# Altium project Field Sensor ESP32.PrjPCB
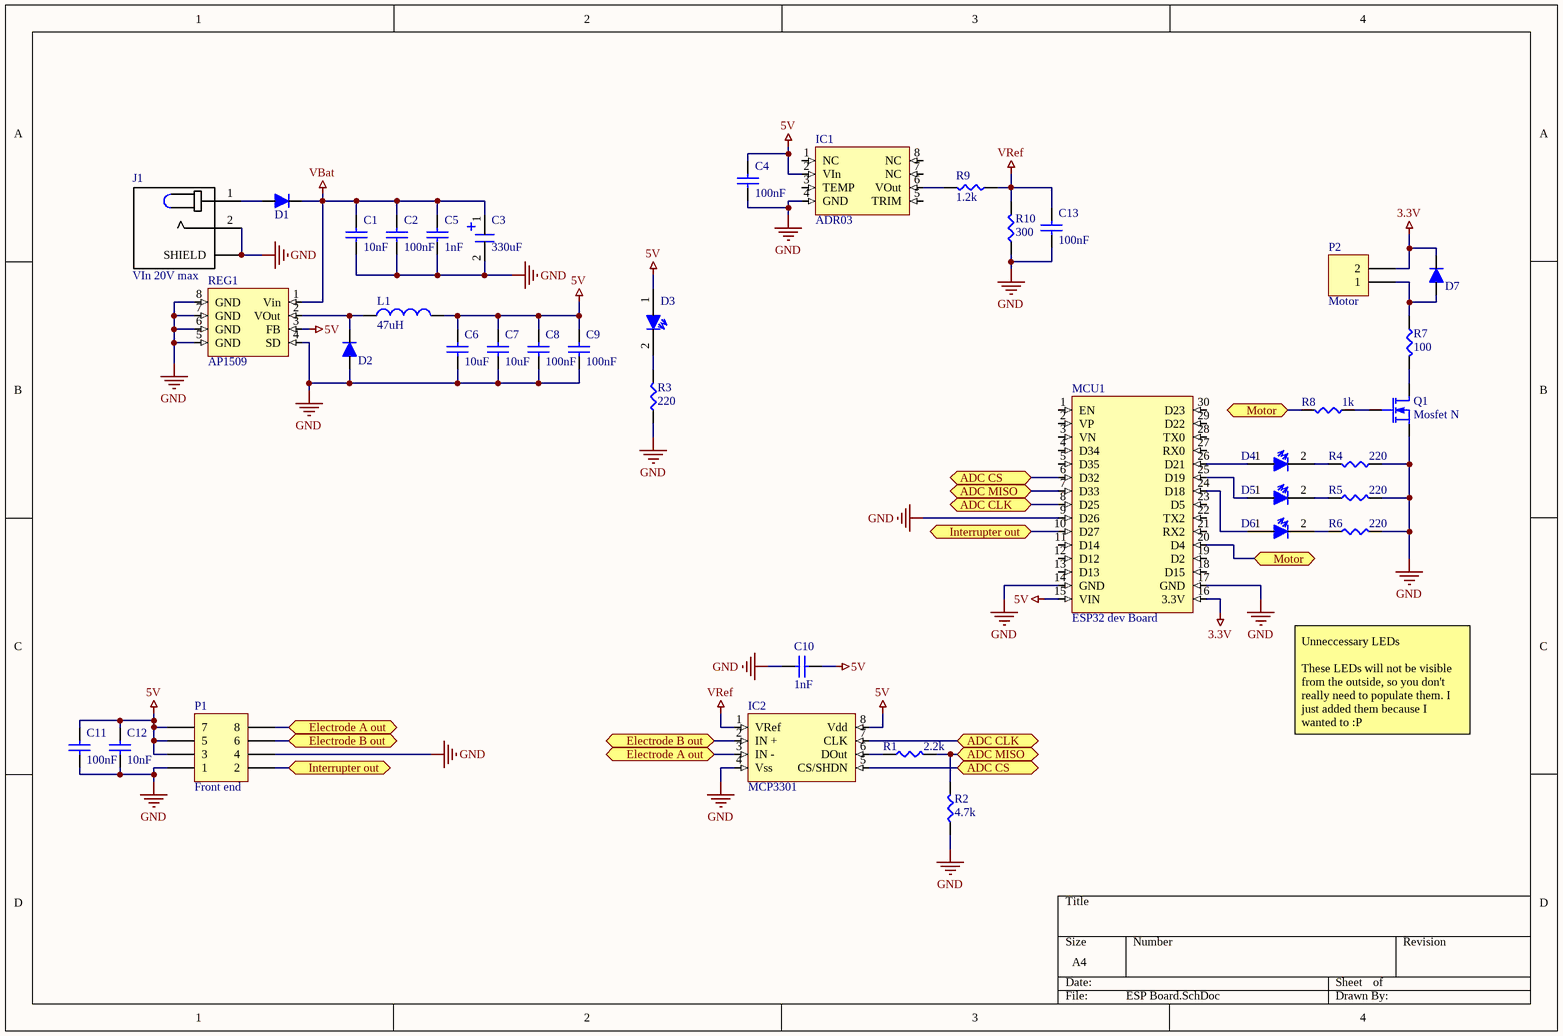
[diagram p0: ESP Board.SchDoc]
1 sheet, 39 parts. Net scope: flat (ports and power ports of the same name join across sheets).
Board file: ESP BOard.PcbDoc

## Sheet ESP Board.SchDoc
size A4

### Parts
C1  10nF  [0805]
C2  100nF  [0805]
C3  330uF  [ESL476M100AH9AA]
C4  100nF  [0805]
C5  1nF  [0805]
C6  10uF  [0805]
C7  10uF  [0805]
C8  100nF  [0805]
C9  100nF  [0805]
C10  1nF  [0805]
C11  100nF  [0805]
C12  10nF  [0805]
C13  100nF  [0805]
D1  Diode  [DO-214]  (value not drawn)
D2  Diode  [DO-214]  (value not drawn)
D3  Power  [0805]  (value not drawn)
D4  NOP  [0805]  (value not drawn)
D5  NOP  [0805]  (value not drawn)
D6  NOP  [0805]  (value not drawn)
D7  Diode  [DO-214]  (value not drawn)
IC1  ADR03  [SOIC8]
IC2  MCP3301  [SOIC8]
J1  VIn 20V max  [PJ-082BH]
L1  47uH  [1812 Low density]
MCU1  ESP32 dev Board  [ESP32 dev board]
P1  Front end  [HDR2X4]
P2  Motor  [XH2]
Q1  Mosfet N  [sot 23]
R1  2.2k  [0805]
R2  4.7k  [0805]
R3  220  [0805]
R4  220  [0805]
R5  220  [0805]
R6  220  [0805]
R7  100  [0805]
R8  1k  [0805]
R9  1.2k  [0805]
R10  300  [0805]
REG1  AP1509  [SOIC8]

### Ports
ADC CLK (bidir), ADC CS (bidir), ADC MISO (bidir), Electrode A out (bidir), Electrode B out (bidir), Interrupter out (bidir), Motor (bidir)

### Nets
3.3V: D7.2 MCU1.16(3.3V) P2.2
5V: C4.2 C6.1 C7.1 C8.1 C9.1 C10.2 C11.2 C12.2 D3.1 IC1.2(VIn) IC2.8(Vdd) L1.1 MCU1.15(VIN) P1.3 P1.5 P1.7 REG1.3(FB)
GND: C1.1 C2.1 C3.2 C4.1 C5.1 C6.2 C7.2 C8.2 C9.2 C10.1 C11.1 C12.1 C13.1 D2.1 IC1.4(GND) IC2.4(Vss) J1.2 J1.3(SHIELD) J1.4(SHIELD) J1.5(SHIELD) J1.6(SHIELD) MCU1.9(D26) MCU1.14(GND) MCU1.17(GND) P1.1 P1.4 Q1.S R2.1 R3.1 R4.1 R5.2 R6.2 R10.1 REG1.4(SD) REG1.5(GND) REG1.6(GND) REG1.7(GND) REG1.8(GND)
VBat: C1.2 C2.2 C3.1 C5.2 D1.2 REG1.1(Vin)
VRef: C13.2 IC2.1(VRef) R9.1 R10.2
NetD1_1: D1.1 J1.1
NetD2_2: D2.2 L1.2 REG1.2(VOut)
NetD3_2: D3.2 R3.2
NetD4_1: D4.1 MCU1.26(D21)
NetD4_2: D4.2 R4.2
NetD5_1: D5.1 MCU1.25(D19)
NetD5_2: D5.2 R5.1
NetD6_1: D6.1 MCU1.24(D18)
NetD6_2: D6.2 R6.1
NetD7_1: D7.1 P2.1 R7.1
NetIC1_6: IC1.6(VOut) R9.2
NetIC2_2: IC2.2(IN_+) P1.6 ; port Electrode B out
NetIC2_3: IC2.3(IN_-) P1.8 ; port Electrode A out
NetIC2_5: IC2.5(CS/SHDN) MCU1.6(D32) ; port ADC CS
NetIC2_6: IC2.6(DOut) R1.1
NetIC2_7: IC2.7(CLK) MCU1.8(D25) ; port ADC CLK
NetMCU1_7: MCU1.7(D33) R1.2 R2.2 ; port ADC MISO
NetMCU1_10: MCU1.10(D27) P1.2 ; port Interrupter out
NetMCU1_20: MCU1.20(D4) R8.2 ; port Motor
NetQ1_D: Q1.D R7.2
NetQ1_G: Q1.G R8.1

Not connected (* = marked no-connect by the designer): IC1 1(NC) 3(TEMP) 5(TRIM) 7(NC) 8(NC); MCU1 1(EN) 2(VP) 3(VN) 4(D34) 5(D35) 11(D14) 12(D12) 13(D13) 18(D15) 19(D2) 21(RX2) 22(TX2) 23(D5) 27(RX0) 28(TX0) 29(D22) 30(D23)

### Notes on the sheet
- Unneccessary LEDs
  These LEDs will not be visible from the outside, so you don't really need to populate them. I just added them because I wanted to :P

### Library data of the parts
C1 C2 C4-C13 = Cap: Supplier 1: Digi-Key; Supplier 2: Digi-Key; Supplier 3: Digi-Key; Supplier Part Number 1: 1276-2044-1-ND; Supplier Part Number 2: 1276-1018-1-ND; Supplier Part Number 3: 1276-1182-1-ND; Supplier 4: Digi-Key; Supplier 5: Digi-Key; Supplier 6: Digi-Key; Supplier 7: Digi-Key; Supplier 8: Digi-Key; Supplier 9: Digi-Key; Supplier Part Number 4: 1276-1009-1-ND; Supplier Part Number 5: 1276-1098-1-ND; Supplier Part Number 6: 1276-1119-1-ND; Supplier Part Number 7: 490-12737-1-ND; Supplier Part Number 9: 587-1249-1-ND; Supplier Part Number 8: 1276-1183-1-ND; Supplier 10: Digi-Key; Supplier 11: Digi-Key; Supplier 12: Digi-Key; Supplier 13: Digi-Key; Supplier Part Number 10: 1276-CL10B104KB8NNNLCT-ND; Supplier Part Number 11: 399-1085-1-ND; Supplier Part Number 13: 587-2985-1-ND; Supplier Part Number 12: 1276-1021-1-ND; Supplier 14: Digi-Key; Supplier 15: Digi-Key; Supplier 16: Digi-Key; Supplier 17: Digi-Key; Supplier 18: Digi-Key; Supplier 19: Digi-Key; Supplier Part Number 14: 490-14603-1-ND; Supplier Part Number 15: 311-3700-1-ND; Supplier Part Number 16: 311-1042-1-ND; Supplier Part Number 17: 311-1415-1-ND; Supplier Part Number 19: 587-4321-1-ND; Supplier Part Number 18: 1276-1907-1-ND; Supplier 20: Digi-Key; Supplier 21: Digi-Key; Supplier 22: Digi-Key; Supplier Part Number 20: 1276-6767-1-ND; Supplier Part Number 21: 1276-7060-1-ND; Supplier Part Number 22: 311-1084-1-ND
C3 = Cap Polar: Supplier 1: Digi-Key; Supplier Part Number 1: 478-9181-1-ND; Supplier 2: Digi-Key; Supplier 3: Digi-Key; Supplier Part Number 2: 478-9173-1-ND; Supplier Part Number 3: 493-11037-ND; Supplier 4: Digi-Key; Supplier 5: Digi-Key; Supplier Part Number 4: PCE3462CT-ND; Supplier Part Number 5: 399-18864-1-ND; Supplier 6: Digi-Key; Supplier Part Number 6: 399-10512-1-ND; Supplier 7: Digi-Key; Supplier Part Number 7: 399-15746-ND; Supplier 8: Digi-Key; Supplier Part Number 8: 1189-3752-1-ND
D1 D2 D7 = Diode: Cmon its a diode what more do I need to say?; Supplier 1: Digi-Key; Supplier Part Number 1: MBR10100GOS-ND; Supplier 2: Digi-Key; Supplier Part Number 2: 1655-1504-1-ND
D3-D6 = LED: Supplier 1: Digi-Key; Supplier 2: Digi-Key; Supplier 3: Digi-Key; Supplier 4: Digi-Key; Supplier Part Number 1: 732-4979-1-ND; Supplier Part Number 2: 732-4971-1-ND; Supplier Part Number 3: 732-4966-1-ND; Supplier Part Number 4: 732-4981-1-ND
IC1 = ADR0X: Precision voltage reference 0.1%; Supplier 1: Digi-Key; Supplier Part Number 1: ADR02ARZ-ND
IC2 = MCP3301: 13 bit differential ADC; Supplier 1: Digi-Key; Supplier Part Number 1: MCP3301-BI/SN-ND
J1 = Barrel Power Plug: Supplier 1: Digi-Key; Supplier Part Number 1: CP-082BHTR-ND
L1 = Inductor: Supplier 1: Digi-Key; Supplier 2: Digi-Key; Supplier Part Number 1: 541-1250-1-ND; Supplier Part Number 2: 541-1253-1-ND; Supplier 3: Digi-Key; Supplier 4: Digi-Key; Supplier Part Number 3: SRN6028-3R9MCT-ND; Supplier Part Number 4: SRN6028-4R7MCT-ND; Supplier 5: Digi-Key; Supplier Part Number 5: 490-10563-1-ND; Supplier 6: Digi-Key; Supplier 7: Digi-Key; Supplier 8: Digi-Key; Supplier 9: Digi-Key; Supplier Part Number 6: 1276-6932-1-ND; Supplier Part Number 7: 587-2042-1-ND; Supplier Part Number 9: SRP1265A-1R0MCT-ND; Supplier Part Number 8: 535-12790-1-ND; Supplier 10: Digi-Key; Supplier Part Number 10: SRP1770TA-5R6MCT-ND; Supplier 11: Digi-Key; Supplier Part Number 11: SRN6028-100MCT-ND; Supplier 12: Digi-Key; Supplier Part Number 12: SRN2510F-2R2MCT-ND; Supplier 13: Digi-Key; Supplier Part Number 13: 490-3992-1-ND
MCU1 = ESP32 dev Board: Dev board of the esp32
P1 = Header 4X2: Header, 4-Pin, Dual row; LatestRevisionDate: 17-Jul-2002; LatestRevisionNote: Re-released for DXP Platform.; Publisher: Altium Limited
P2 = Header 2: Header, 2-Pin; LatestRevisionDate: 17-Jul-2002; LatestRevisionNote: Re-released for DXP Platform.; Publisher: Altium Limited
Q1 = Mosfet N: pin to pad: D>3 G>1 S>2; Supplier 1: Digi-Key; Supplier Part Number 1: 1727-5305-1-ND; Supplier 2: Digi-Key; Supplier Part Number 2: 1727-1123-1-ND; Supplier 3: Digi-Key; Supplier 4: Digi-Key; Supplier Part Number 4: T2N7002AKLMCT-ND; Supplier Part Number 3: BSC0906NSATMA1CT-ND; Supplier 5: Digi-Key; Supplier Part Number 5: 1727-4714-1-ND; Supplier 6: Digi-Key; Supplier 7: Digi-Key; Supplier Part Number 6: 497-14572-5-ND; Supplier Part Number 7: IPP180N10N3GXKSA1-ND
R1-R10 = Resistor: Supplier 1: Digi-Key; Supplier 2: Digi-Key; Supplier Part Number 1: RHM10DCT-ND; Supplier Part Number 2: 696-1834-1-ND; Supplier 3: Digi-Key; Supplier 4: Digi-Key; Supplier 5: Digi-Key; Supplier 6: Digi-Key; Supplier 7: Digi-Key; Supplier Part Number 3: RMCF0603JT3K90CT-ND; Supplier Part Number 5: RHM100DCT-ND; Supplier Part Number 6: RMCF0603FT54K9CT-ND; Supplier Part Number 7: RMCF0603FT40K2CT-ND; Supplier Part Number 4: RHM1.0KDCT-ND; Supplier 8: Digi-Key; Supplier 9: Digi-Key; Supplier 10: Digi-Key; Supplier 11: Digi-Key; Supplier Part Number 10: 311-200JRCT-ND; Supplier Part Number 11: 311-300JRCT-ND; Supplier Part Number 8: P200LCT-ND; Supplier Part Number 9: 311-1.0KJRCT-ND; Supplier 12: Digi-Key; Supplier 13: Digi-Key; Supplier 14: Digi-Key; Supplier 15: Digi-Key; Supplier 16: Digi-Key; Supplier 17: Digi-Key; Supplier Part Number 12: YAG3356CT-ND; Supplier Part Number 13: 311-220GRCT-ND; Supplier Part Number 14: 311-220KGRCT-ND; Supplier Part Number 15: 311-1.0KGRCT-ND; Supplier Part Number 16: 311-200KHRCT-ND; Supplier Part Number 17: A102451-ND; Supplier 18: Digi-Key; Supplier Part Number 18: 311-2.00KHRCT-ND; Supplier 19: Digi-Key; Supplier Part Number 19: 311-10KGRCT-ND; Supplier 20: Digi-Key; Supplier 21: Digi-Key; Supplier 22: Digi-Key; Supplier 23: Digi-Key; Supplier 24: Digi-Key; Supplier 25: Digi-Key; Supplier 26: Digi-Key; Supplier 27: Digi-Key; Supplier 28: Digi-Key; Supplier 29: Digi-Key; Supplier Part Number 29: 311-499KLRCT-ND; Supplier Part Number 28: 311-200KJRCT-ND; Supplier Part Number 26: YAG3226CT-ND; Supplier Part Number 20: 311-1.00LRCT-ND; Supplier Part Number 25: 311-12KJRCT-ND; Supplier Part Number 24: 311-10.0KLRCT-ND; Supplier Part Number 23: 311-4.7KJRCT-ND; Supplier Part Number 22: 311-2.2KJRCT-ND; Supplier Part Number 21: 311-220JRCT-ND; Supplier Part Number 27: 311-75KJRCT-ND; Supplier 30: Digi-Key; Supplier 31: Digi-Key; Supplier 32: Digi-Key; Supplier Part Number 32: 541-3127-6-ND; Supplier Part Number 31: 696-1677-1-ND; Supplier Part Number 30: YAG6087CT-ND; Supplier 33: Digi-Key; Supplier 34: Digi-Key; Supplier 35: Digi-Key; Supplier 36: Digi-Key; Supplier 37: Digi-Key; Supplier 38: Digi-Key; Supplier 39: Digi-Key; Supplier 40: Digi-Key; Supplier 41: Digi-Key; Supplier 42: Arrow; Supplier Part Number 33: 311-47.0HRCT-ND; Supplier Part Number 34: 311-470HRCT-ND; Supplier Part Number 37: 311-5.23KHRCT-ND; Supplier Part Number 36: 311-100KGRCT-ND; Supplier Part Number 35: 311-470KGRCT-ND; Supplier Part Number 38: 311-52.3KHRCT-ND; Supplier Part Number 39: 311-22KGRCT-ND; Supplier Part Number 41: 311-7.15KHRCT-ND; Supplier Part Number 42: RC0603FR-072K2L; Supplier Part Number 40: 311-15.8KHRCT-ND
REG1 = AP1509: Fixed voltage buck regulator; Supplier 1: Digi-Key; Supplier Part Number 1: AP1509-50SGDICT-ND